# Altium schematic sheet ICSP_breakout.SchDoc
size A
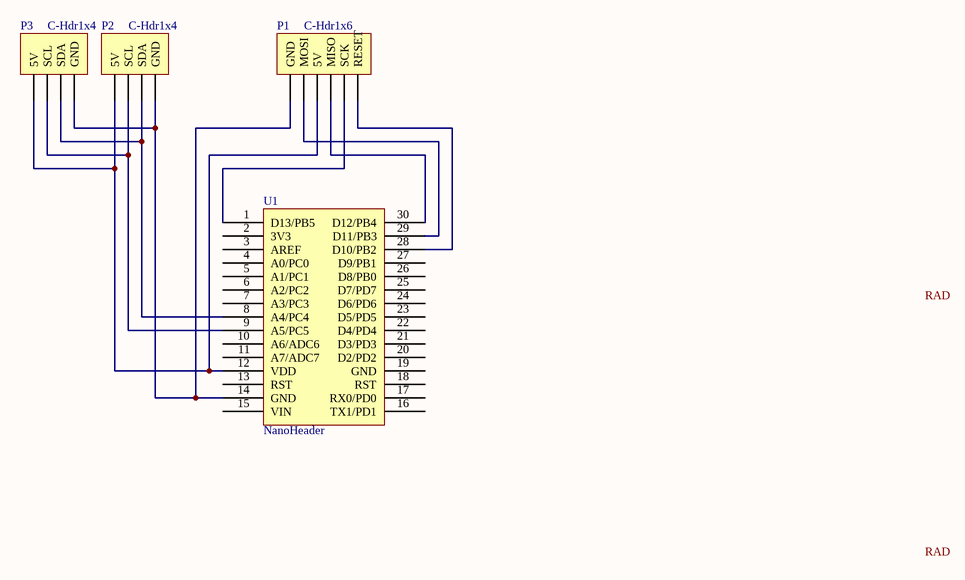
[diagram p0: ICSP_breakout.SchDoc]

## Parts
P1  C-Hdr1x6  [HDR1X6_LGE1.0]
P2  C-Hdr1x4  [HDR1X4_LGE1.0]
P3  C-Hdr1x4  [HDR1X4_LGE1.0]
U1  NanoHeader  [DIP30W]

## Nets
NetP1_1: P1.1(GND) P2.4(GND) P3.4(GND) U1.14(GND)
NetP1_2: P1.2(MOSI) U1.29(D11/PB3)
NetP1_3: P1.3(5V) P2.1(5V) P3.1(5V) U1.12(VDD)
NetP1_4: P1.4(MISO) U1.30(D12/PB4)
NetP1_5: P1.5(SCK) U1.1(D13/PB5)
NetP1_6: P1.6(RESET) U1.28(D10/PB2)
NetP2_2: P2.2(SCL) P3.2(SCL) U1.9(A5/PC5)
NetP2_3: P2.3(SDA) P3.3(SDA) U1.8(A4/PC4)

Not connected (* = marked no-connect by the designer): U1 2(3V3) 3(AREF) 4(A0/PC0) 5(A1/PC1) 6(A2/PC2) 7(A3/PC3) 10(A6/ADC6) 11(A7/ADC7) 13(RST) 15(VIN) 16(TX1/PD1) 17(RX0/PD0) 18(RST) 19(GND) 20(D2/PD2) 21(D3/PD3) 22(D4/PD4) 23(D5/PD5) 24(D6/PD6) 25(D7/PD7) 26(D8/PB0) 27(D9/PB1)

## Notes on the sheet
- Labels drawn without touching a wire or pin: RAD

## Library data of the parts
P1 = C-Hdr1x6: Header, 6-Pin; LatestRevisionDate: 17-Jul-2002; LatestRevisionNote: Re-released for DXP Platform.; Publisher: Altium Limited
P2 P3 = C-Hdr1x4: Header, 4-Pin; LatestRevisionDate: 17-Jul-2002; LatestRevisionNote: Re-released for DXP Platform.; Publisher: Altium Limited